# Altium schematic sheet MOTOR1.SchDoc
size B
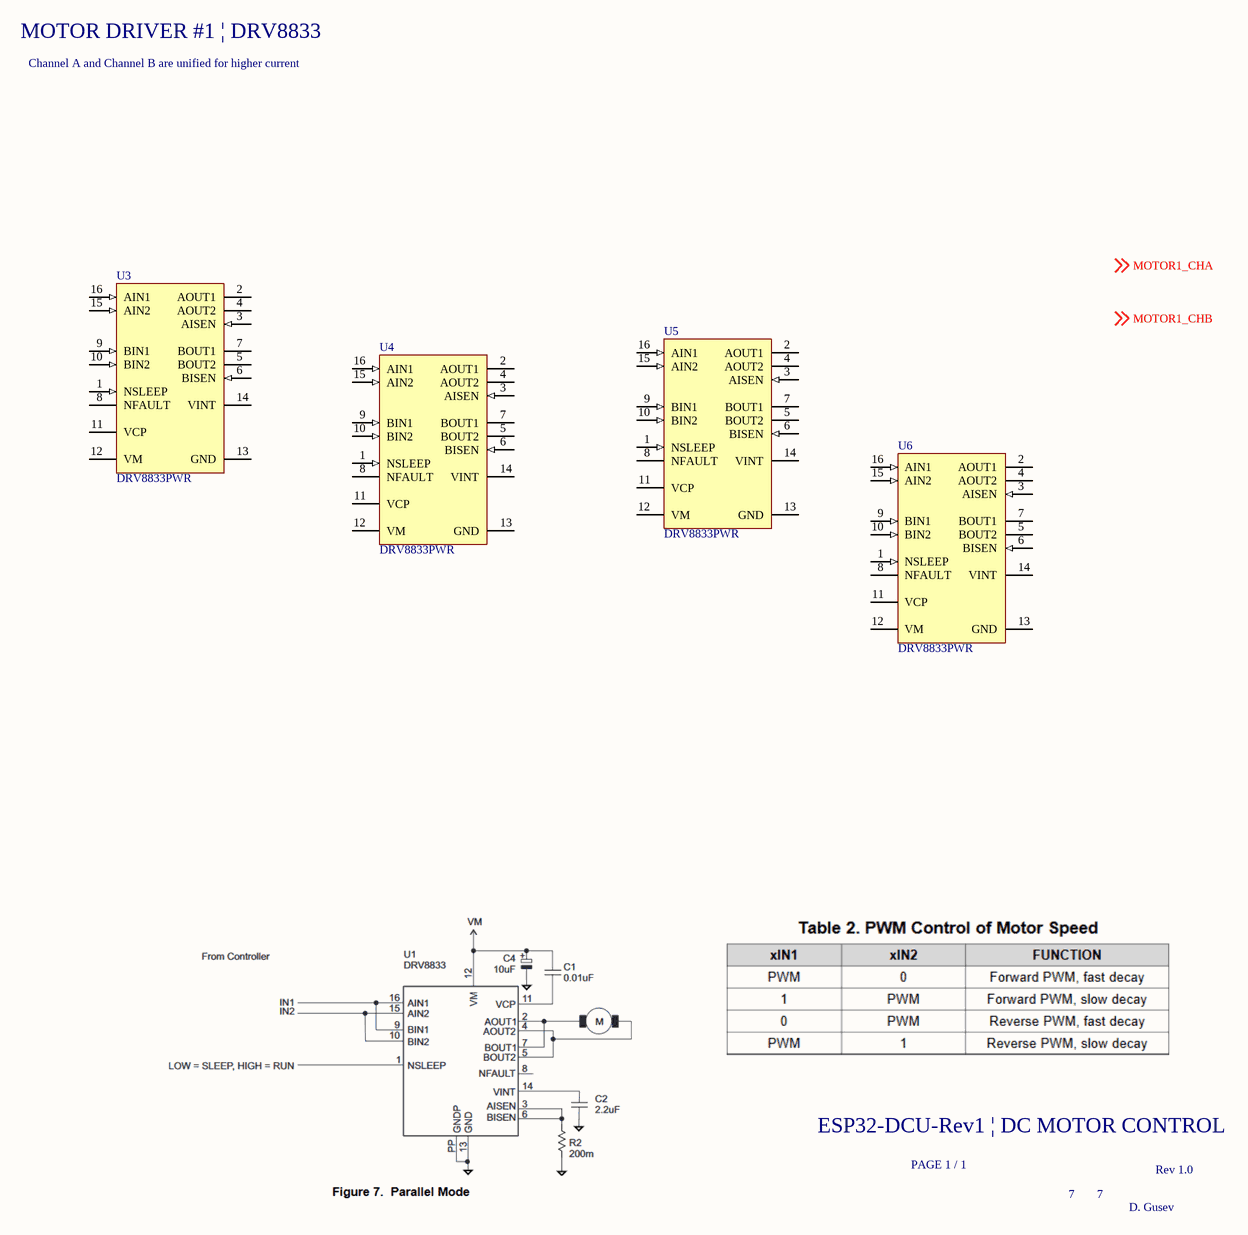
[diagram p0: MOTOR1.SchDoc]

## Parts
U3  DRV8833PWR  [PW0016A_L]
U4  DRV8833PWR  [PW0016A_L]
U5  DRV8833PWR  [PW0016A_L]
U6  DRV8833PWR  [PW0016A_L]

## Nets

Not connected (* = marked no-connect by the designer): U3 1(NSLEEP) 2(AOUT1) 3(AISEN) 4(AOUT2) 5(BOUT2) 6(BISEN) 7(BOUT1) 8(NFAULT) 9(BIN1) 10(BIN2) 11(VCP) 12(VM) 13(GND) 14(VINT) 15(AIN2) 16(AIN1); U4 1(NSLEEP) 2(AOUT1) 3(AISEN) 4(AOUT2) 5(BOUT2) 6(BISEN) 7(BOUT1) 8(NFAULT) 9(BIN1) 10(BIN2) 11(VCP) 12(VM) 13(GND) 14(VINT) 15(AIN2) 16(AIN1); U5 1(NSLEEP) 2(AOUT1) 3(AISEN) 4(AOUT2) 5(BOUT2) 6(BISEN) 7(BOUT1) 8(NFAULT) 9(BIN1) 10(BIN2) 11(VCP) 12(VM) 13(GND) 14(VINT) 15(AIN2) 16(AIN1); U6 1(NSLEEP) 2(AOUT1) 3(AISEN) 4(AOUT2) 5(BOUT2) 6(BISEN) 7(BOUT1) 8(NFAULT) 9(BIN1) 10(BIN2) 11(VCP) 12(VM) 13(GND) 14(VINT) 15(AIN2) 16(AIN1)

## Notes on the sheet
- MOTOR DRIVER #1 | DRV8833
- Channel A and Channel B are unified for higher current
- ESP32-DCU-Rev1 | DC MOTOR CONTROL
- PAGE 1 / 1
- 7
- Rev 1.0
- D. Gusev
- Labels drawn without touching a wire or pin: MOTOR1_CHA, MOTOR1_CHB

## Library data of the parts
U3-U6 = CMP-1529-00001-2: 2 A Low Voltage Dual Brushed DC or Single Bipolar Stepper Motor Driver (PWM Ctrl), 2.7 to 10.8 V, -40 to 85 degC, 16-Pin SOP (PW), Green (RoHS & no Sb/Br), Tape and Reel; Manufacturer: Texas Instruments; Vs: 2.7 V Min.; Peak Output Current: 2 A; rDS (ON) (LS + HS): 360 mOhms; RMS Output Current: 1.5 A; DatasheetVersion: SLVSAR1D; Mounting Technology: Surface Mount; ComponentLink2URL: http://www.ti.com/lit/ds/symlink/drv8833.pdf; Packing: Tape and Reel; Temperature Range: -40 to 85 degC; Eco-Plan: Green (RoHS & no Sb/Br); Package Reference: PW0016A; PackageDescription: 16-Pin Plastic Small Outline, Body 4.4 x 5 mm, Pitch 0.65 mm; ComponentLink1URL: www.ti.com; ComponentLink2Description: Datasheet; ComponentLink3Description: Package Specification; Control I/F: PWM; PackageVersion: 4040064-4/G; ComponentLink3URL: http://www.ti.com/lit/ml/mpds361/mpds361.pdf; PartNumber: DRV8833PWR; ComponentLink1Description: Manufacturer URL